# Altium schematic sheet STM32主板V1.0.SchDoc
size 660 x 241 mm
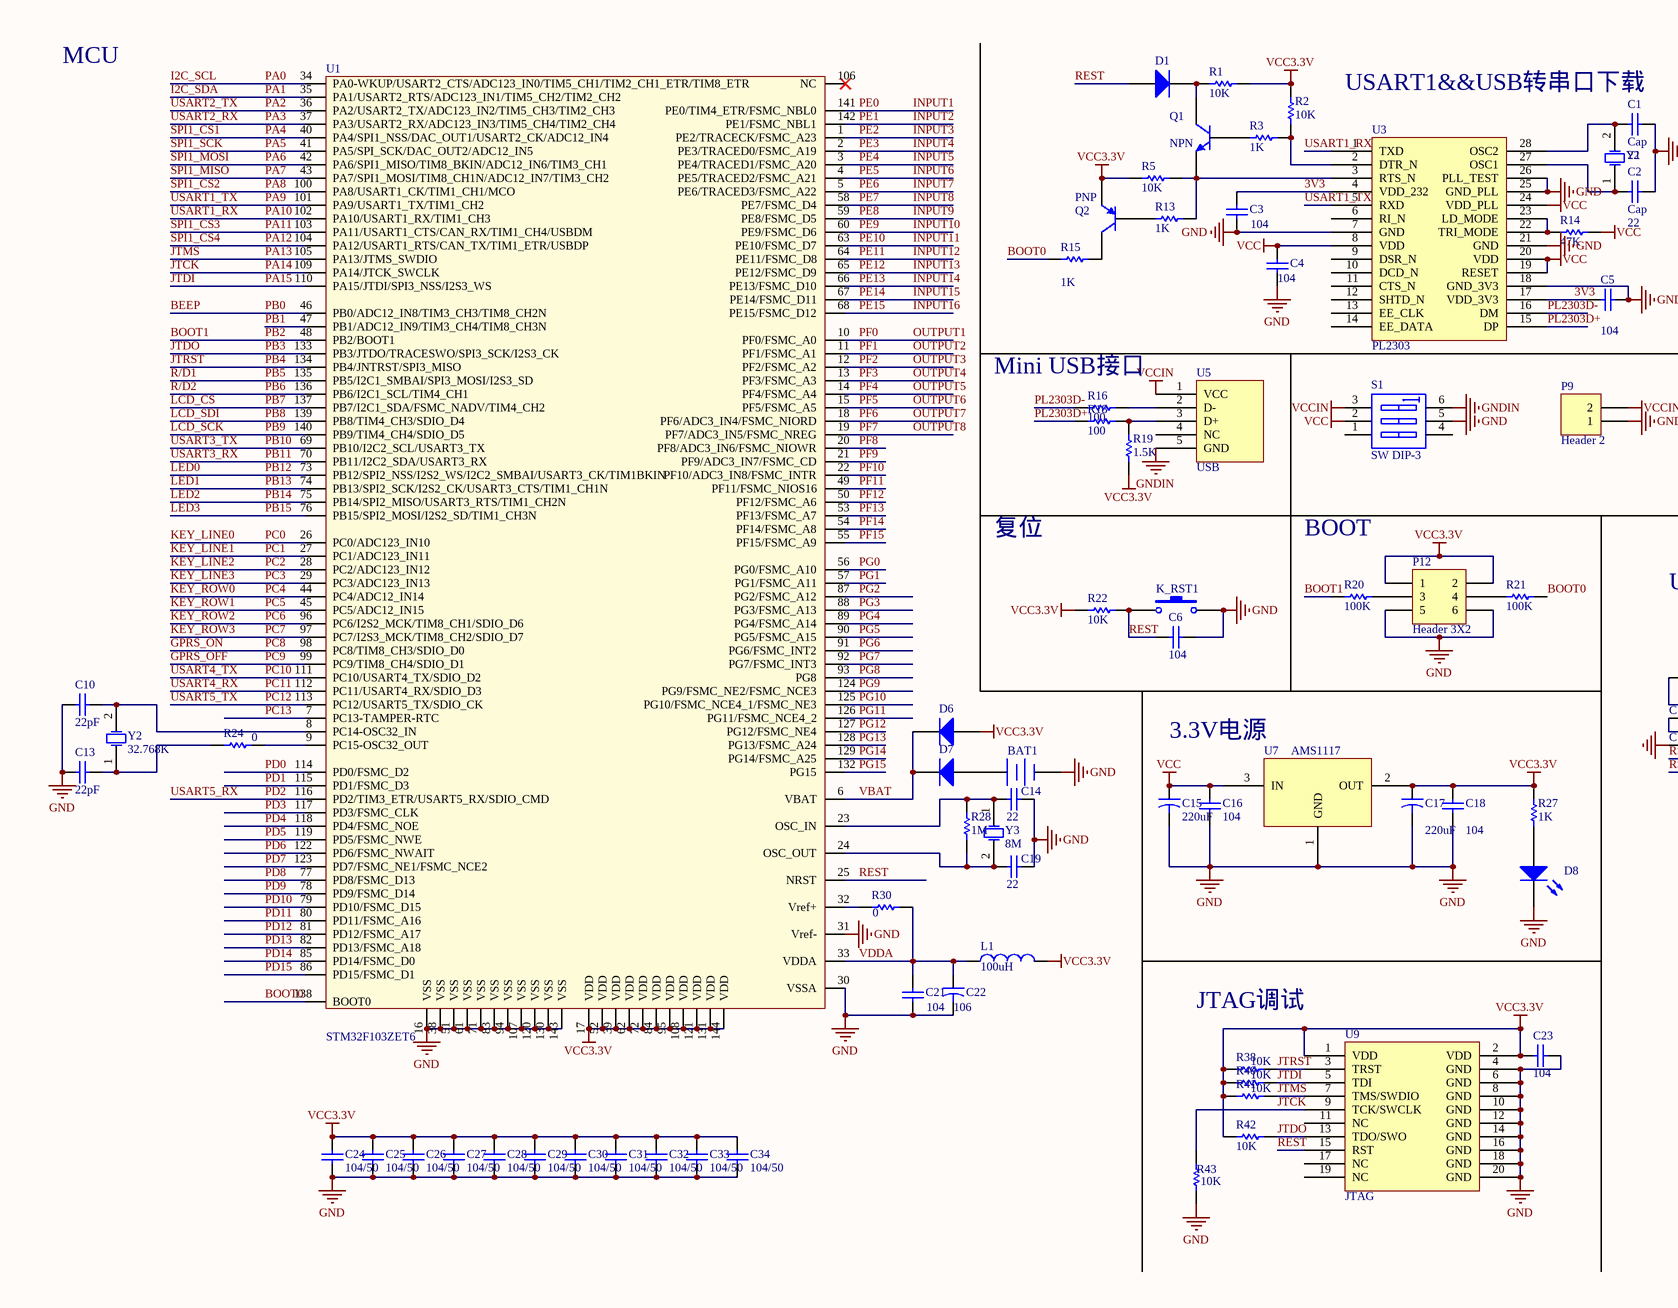
[diagram p0: STM32主板V1.0.SchDoc, left]
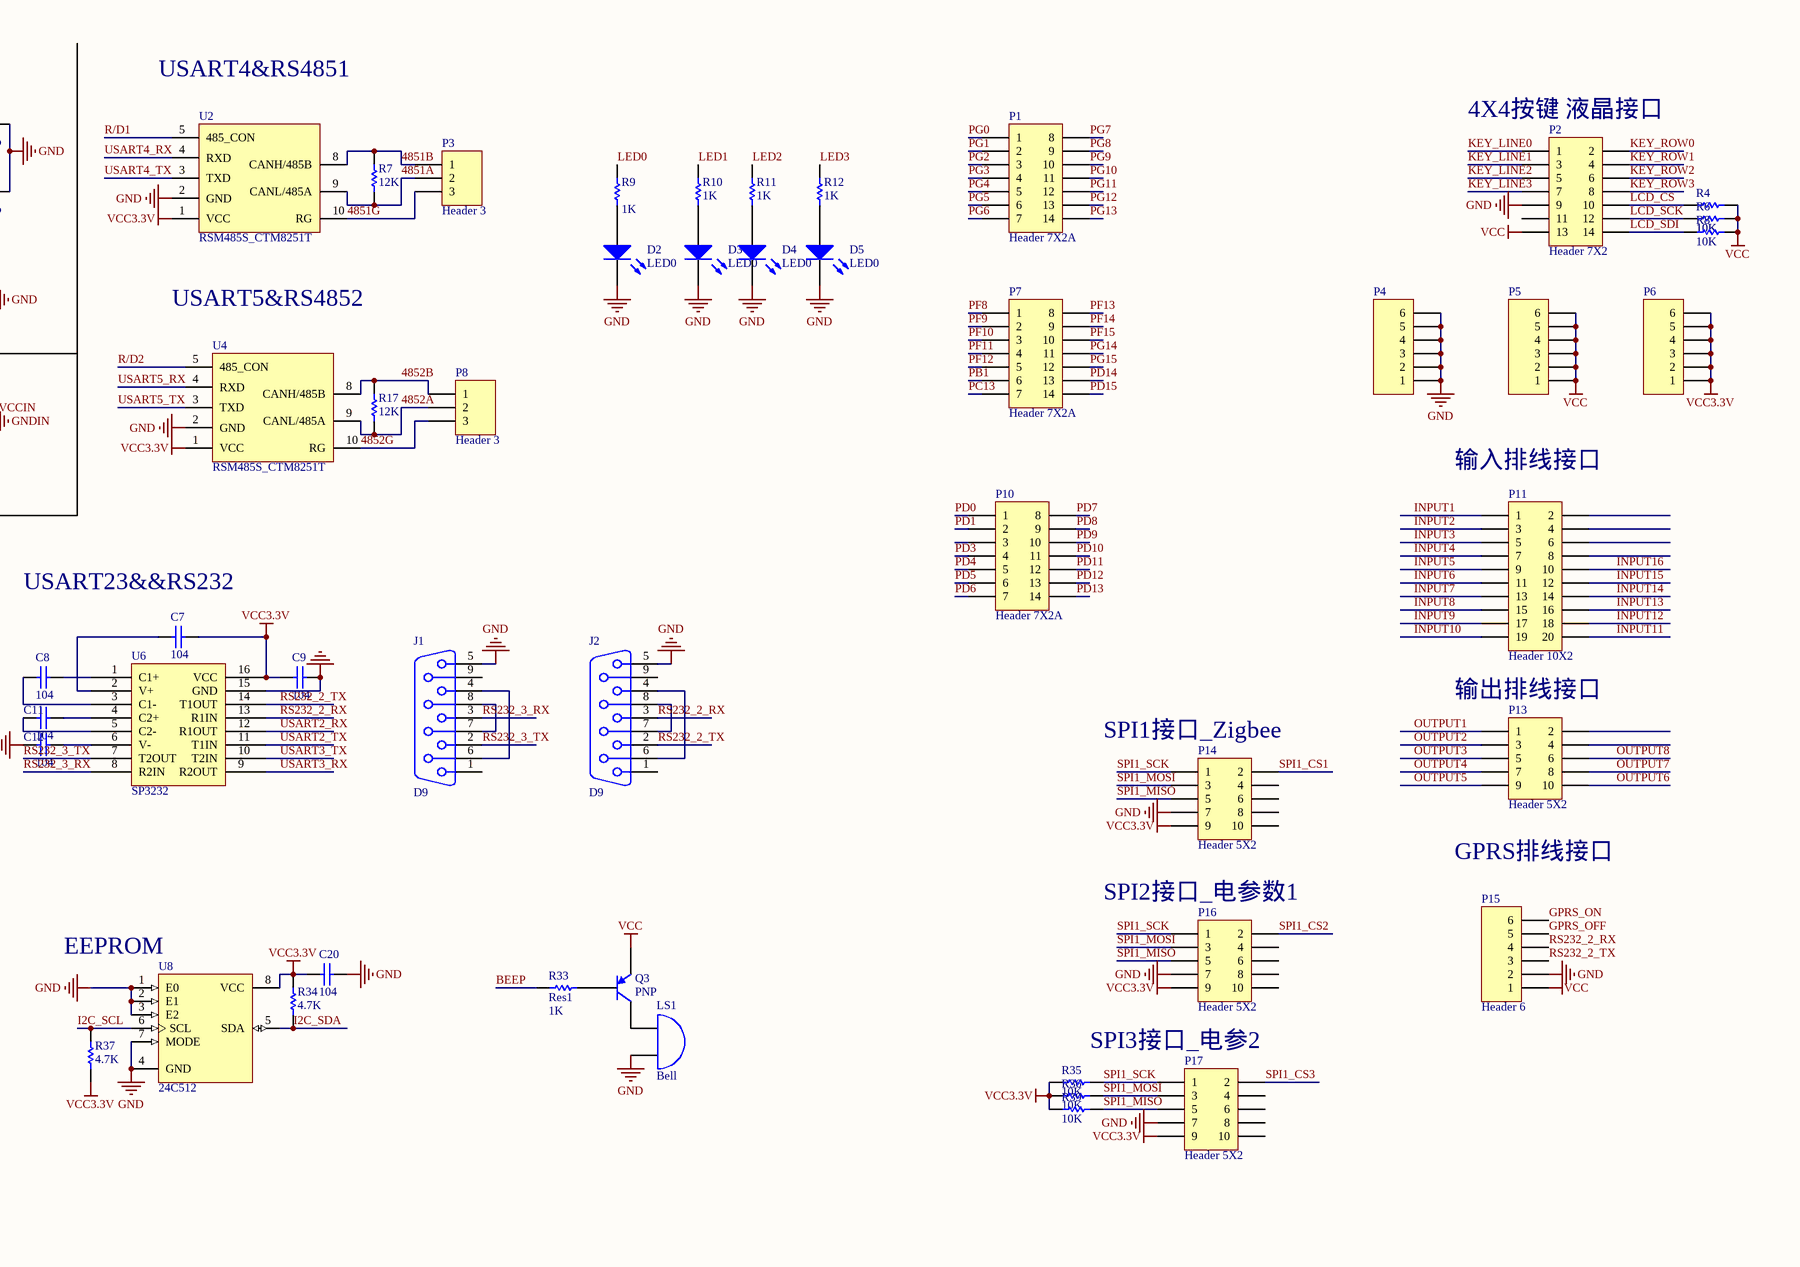
[diagram p1: STM32主板V1.0.SchDoc, right]

## Parts
BAT1  Battery  [电池槽]  (value not drawn)
C1  Cap  value 22  [普通贴片电容]
C2  Cap  value 22  [普通贴片电容]
C3  value 104  [普通贴片电容]  (hidden comment: Cap)
C4  value 104  [普通贴片电容]  (hidden comment: Cap)
C5  value 104  [普通贴片电容]  (hidden comment: Cap)
C6  value 104  [普通贴片电容]  (hidden comment: Cap)
C7  value 104  [普通贴片电容]
C8  value 104  [普通贴片电容]
C9  value 104  [普通贴片电容]
C10  value 22pF  [普通贴片电容]  (hidden comment: Cap)
C11  value 104  [普通贴片电容]
C12  value 104  [普通贴片电容]
C13  value 22pF  [普通贴片电容]  (hidden comment: Cap)
C14  22  [普通贴片电容]
C15  value 220uF  [电容100uf]  (hidden comment: Cap2)
C16  value 104  [普通贴片电容]  (hidden comment: Cap)
C17  value 220uF  [电容100uf]  (hidden comment: Cap2)
C18  value 104  [普通贴片电容]  (hidden comment: Cap)
C19  22  [普通贴片电容]
C20  value 104  [普通贴片电容]  (hidden comment: Cap)
C21  value 104  [普通贴片电容]  (hidden comment: Cap)
C22  value 106  [普通贴片电容]  (hidden comment: Cap2)
C23  value 104  [普通贴片电容]  (hidden comment: Cap)
C24  value 104/50  [普通贴片电容]  (hidden comment: Cap)
C25  value 104/50  [普通贴片电容]  (hidden comment: Cap)
C26  value 104/50  [普通贴片电容]  (hidden comment: Cap)
C27  value 104/50  [普通贴片电容]  (hidden comment: Cap)
C28  value 104/50  [普通贴片电容]  (hidden comment: Cap)
C29  value 104/50  [普通贴片电容]  (hidden comment: Cap)
C30  value 104/50  [普通贴片电容]  (hidden comment: Cap)
C31  value 104/50  [普通贴片电容]  (hidden comment: Cap)
C32  value 104/50  [普通贴片电容]  (hidden comment: Cap)
C33  value 104/50  [普通贴片电容]  (hidden comment: Cap)
C34  value 104/50  [普通贴片电容]  (hidden comment: Cap)
D1  Diode  [贴片二极管]  (value not drawn)
D2  LED0  [贴片LED灯]
D3  LED0  [贴片LED灯]
D4  LED0  [贴片LED灯]
D5  LED0  [贴片LED灯]
D6  Diode 1N4148  [贴片二极管]  (value not drawn)
D7  Diode 1N4148  [贴片二极管]  (value not drawn)
D8  LED0  [贴片LED灯]  (value not drawn)
J1  D9  [串口]
J2  D9  [串口]
K_RST1  SW-PB  [按键]  (value not drawn)
L1  value 100uH  [贴片电阻]  (hidden comment: Inductor)
LS1  Bell  [BELL]
P1  Header 7X2A  [CON14a]
P2  Header 7X2  [CON14]
P3  Header 3  [HDR1X3]
P4  Header 6  [HDR1X6]  (value not drawn)
P5  Header 6  [HDR1X6]  (value not drawn)
P6  Header 6  [HDR1X6]  (value not drawn)
P7  Header 7X2A  [CON14a]
P8  Header 3  [HDR1X3]
P9  Header 2  [HDR1X2]
P10  Header 7X2A  [CON14a]
P11  Header 10X2  [CON20]
P12  Header 3X2  [HDR2X3]
P13  Header 5X2  [CON10]
P14  Header 5X2  [CON10]
P15  Header 6  [HDR1X6]
P16  Header 5X2  [CON10]
P17  Header 5X2  [CON10]
Q1  NPN  [三极管 NPN]
Q2  PNP  [三极管 PNP]
Q3  PNP  [三极管 PNP]
R1  value 10K  [贴片电阻]  (hidden comment: Res1)
R2  value 10K  [贴片电阻]  (hidden comment: Res1)
R3  value 1K  [贴片电阻]  (hidden comment: Res1)
R4  value 10K  [贴片电阻]  (hidden comment: Res1)
R5  value 10K  [贴片电阻]  (hidden comment: Res1)
R6  value 10K  [贴片电阻]  (hidden comment: Res1)
R7  value 12K  [贴片电阻]  (hidden comment: Res1)
R8  value 10K  [贴片电阻]  (hidden comment: Res1)
R9  value 1K  [贴片电阻]  (hidden comment: Res1)
R10  value 1K  [贴片电阻]  (hidden comment: Res1)
R11  value 1K  [贴片电阻]  (hidden comment: Res1)
R12  value 1K  [贴片电阻]  (hidden comment: Res1)
R13  value 1K  [贴片电阻]  (hidden comment: Res1)
R14  value 47K  [贴片电阻]  (hidden comment: Res1)
R15  value 1K  [贴片电阻]  (hidden comment: Res1)
R16  value 100  [贴片电阻]  (hidden comment: Res1)
R17  value 12K  [贴片电阻]  (hidden comment: Res1)
R18  value 100  [贴片电阻]  (hidden comment: Res1)
R19  value 1.5K  [贴片电阻]  (hidden comment: Res1)
R20  value 100K  [贴片电阻]  (hidden comment: Res1)
R21  value 100K  [贴片电阻]  (hidden comment: Res1)
R22  value 10K  [贴片电阻]  (hidden comment: Res1)
R24  value 0  [贴片电阻]  (hidden comment: Res1)
R27  value 1K  [贴片电阻]  (hidden comment: Res1)
R28  value 1M  [贴片电阻]  (hidden comment: Res1)
R30  value 0  [贴片电阻]  (hidden comment: Res1)
R33  Res1  value 1K  [贴片电阻]
R34  value 4.7K  [贴片电阻]  (hidden comment: Res1)
R35  value 10K  [贴片电阻]  (hidden comment: Res1)
R36  value 10K  [贴片电阻]  (hidden comment: Res1)
R37  value 4.7K  [贴片电阻]  (hidden comment: Res1)
R38  value 10K  [贴片电阻]  (hidden comment: Res1)
R39  value 10K  [贴片电阻]  (hidden comment: Res1)
R40  value 10K  [贴片电阻]  (hidden comment: Res1)
R41  value 10K  [贴片电阻]  (hidden comment: Res1)
R42  value 10K  [贴片电阻]  (hidden comment: Res1)
R43  value 10K  [贴片电阻]  (hidden comment: Res1)
S1  SW DIP-3  [开关]
U1  STM32F103ZET6  [LQFP144]
U2  RSM485S_CTM8251T  [RS485]
U3  PL2303  [SSOP28]
U4  RSM485S_CTM8251T  [RS485]
U5  USB  [miniUSB]
U6  SP3232  [SSOP16]
U7  AMS1117  [AMS1117]
U8  24C512  [SOP8]
U9  JTAG  [CON20]
Y1  XTAL  [晶振]  (value not drawn)
Y2  32.768K  [R38]
Y3  8M  [晶振]

## Nets
GND: BAT1.2(-) C1.1 C2.1 C3.1 C4.1 C5.2 C6.2 C9.2 C10.2 C12.1 C13.2 C14.1 C15.2 C16.1 C17.2 C18.1 C19.1 C20.1 C21.1 C22.2 C23.1 C24.1 C25.1 C26.1 C27.1 C28.1 C29.1 C30.1 C31.1 C32.1 C33.1 C34.1 D2.2(K) D3.2(K) D4.2(K) D5.2(K) D8.2(K) J1.5 J2.5 K_RST1.2 LS1.2(B) P2.9 P4.1 P4.2 P4.3 P4.4 P4.5 P4.6 P12.5 P12.6 P14.7 P15.2 P16.7 P17.7 R43.1 S1.5(B2) U1.16(VSS) U1.30(VSSA) U1.31(Vref-) U1.38(VSS) U1.51(VSS) U1.61(VSS) U1.71(VSS) U1.83(VSS) U1.94(VSS) U1.107(VSS) U1.120(VSS) U1.130(VSS) U1.143(VSS) U2.2(GND) U3.7(GND) U3.18(GND_3V3) U3.21(GND) U3.25(GND_PLL) U3.26(PLL_TEST) U4.2(GND) U6.15(GND) U7.1(GND) U8.1(E0) U8.2(E1) U8.3(E2) U8.4(GND) U8.7(MODE) U9.4(GND) U9.6(GND) U9.8(GND) U9.10(GND) U9.12(GND) U9.14(GND) U9.16(GND) U9.18(GND) U9.20(GND)
GNDIN: P9.1 S1.6(B1) U5.5(GND)
VCC: C4.2 C15.1 C16.2 P2.13 P5.1 P5.2 P5.3 P5.4 P5.5 P5.6 P15.1 Q3.3(E) R4.2 R6.2 R8.2 R14.2 S1.2(A2) U3.8(VDD) U3.19(RESET) U3.20(VDD) U3.24(VDD_PLL) U7.3(IN)
VCC3.3V: C7.2 C9.1 C17.1 C18.2 C20.2 C23.2 C24.2 C25.2 C26.2 C27.2 C28.2 C29.2 C30.2 C31.2 C32.2 C33.2 C34.2 D6.1(A) L1.2 P6.1 P6.2 P6.3 P6.4 P6.5 P6.6 P12.1 P12.2 P14.9 P16.9 P17.9 Q2.3(E) R1.2 R2.2 R5.1 R19.1 R22.2 R27.1 R34.2 R35.2 R36.2 R37.1 R38.1 R39.2 R40.1 R41.1 R42.1 U1.17(VDD) U1.39(VDD) U1.52(VDD) U1.62(VDD) U1.72(VDD) U1.84(VDD) U1.95(VDD) U1.108(VDD) U1.121(VDD) U1.131(VDD) U1.144(VDD) U2.1(VCC) U4.1(VCC) U6.16(VCC) U7.2(OUT) U8.8(VCC) U9.1(VDD) U9.2(VDD)
VCCIN: P9.2 S1.3(A3) U5.1(VCC)
3V3: C3.2 C5.1 U3.4(VDD_232) U3.17(VDD_3V3)
4851A: P3.2 R7.1 U2.9(CANL/485A)
4851B: P3.1 R7.2 U2.8(CANH/485B)
4851G: P3.3 U2.10(RG)
4852A: P8.2 R17.1 U4.9(CANL/485A)
4852B: P8.1 R17.2 U4.8(CANH/485B)
4852G: P8.3 U4.10(RG)
BEEP: R33.1 U1.46(PB0/ADC12_IN8/TIM3_CH3/TIM8_CH2N)  [also labelled PB0]
BOOT0: R15.1 R21.2 U1.138(BOOT0)
BOOT1: R20.1 U1.48(PB2/BOOT1)  [also labelled PB2]
GPRS_OFF: P15.5 U1.99(PC9/TIM8_CH4/SDIO_D1)  [also labelled PC9]
GPRS_ON: P15.6 U1.98(PC8/TIM8_CH3/SDIO_D0)  [also labelled PC8]
I2C_SCL: R37.2 U1.34(PA0-WKUP/USART2_CTS/ADC123_IN0/TIM5_CH1/TIM2_CH1_ETR/TIM8_ETR) U8.6(SCL)  [also labelled PA0]
I2C_SDA: R34.1 U1.35(PA1/USART2_RTS/ADC123_IN1/TIM5_CH2/TIM2_CH2) U8.5(SDA)  [also labelled PA1]
INPUT1: P11.1 U1.141(PE0/TIM4_ETR/FSMC_NBL0)  [also labelled PE0]
INPUT2: P11.3 U1.142(PE1/FSMC_NBL1)  [also labelled PE1]
INPUT3: P11.5 U1.1(PE2/TRACECK/FSMC_A23)  [also labelled PE2]
INPUT4: P11.7 U1.2(PE3/TRACED0/FSMC_A19)  [also labelled PE3]
INPUT5: P11.9 U1.3(PE4/TRACED1/FSMC_A20)  [also labelled PE4]
INPUT6: P11.11 U1.4(PE5/TRACED2/FSMC_A21)  [also labelled PE5]
INPUT7: P11.13 U1.5(PE6/TRACED3/FSMC_A22)  [also labelled PE6]
INPUT8: P11.15 U1.58(PE7/FSMC_D4)  [also labelled PE7]
INPUT9: P11.17 U1.59(PE8/FSMC_D5)  [also labelled PE8]
INPUT10: P11.19 U1.60(PE9/FSMC_D6)  [also labelled PE9]
INPUT11: P11.20 U1.63(PE10/FSMC_D7)  [also labelled PE10]
INPUT12: P11.18 U1.64(PE11/FSMC_D8)  [also labelled PE11]
INPUT13: P11.16 U1.65(PE12/FSMC_D9)  [also labelled PE12]
INPUT14: P11.14 U1.66(PE13/FSMC_D10)  [also labelled PE13]
INPUT15: P11.12 U1.67(PE14/FSMC_D11)  [also labelled PE14]
INPUT16: P11.10 U1.68(PE15/FSMC_D12)  [also labelled PE15]
JTCK: R43.2 U1.109(PA14/JTCK_SWCLK) U9.9(TCK/SWCLK)  [also labelled PA14]
JTDI: R40.2 U1.110(PA15/JTDI/SPI3_NSS/I2S3_WS) U9.5(TDI)  [also labelled PA15]
JTDO: R42.2 U1.133(PB3/JTDO/TRACESWO/SPI3_SCK/I2S3_CK) U9.13(TDO/SWO)  [also labelled PB3]
JTMS: R41.2 U1.105(PA13/JTMS_SWDIO) U9.7(TMS/SWDIO)  [also labelled PA13]
JTRST: R38.2 U1.134(PB4/JNTRST/SPI3_MISO) U9.3(TRST)  [also labelled PB4]
KEY_LINE0: P2.1 U1.26(PC0/ADC123_IN10)  [also labelled PC0]
KEY_LINE1: P2.3 U1.27(PC1/ADC123_IN11)  [also labelled PC1]
KEY_LINE2: P2.5 U1.28(PC2/ADC123_IN12)  [also labelled PC2]
KEY_LINE3: P2.7 U1.29(PC3/ADC123_IN13)  [also labelled PC3]
KEY_ROW0: P2.2 U1.44(PC4/ADC12_IN14)  [also labelled PC4]
KEY_ROW1: P2.4 U1.45(PC5/ADC12_IN15)  [also labelled PC5]
KEY_ROW2: P2.6 U1.96(PC6/I2S2_MCK/TIM8_CH1/SDIO_D6)  [also labelled PC6]
KEY_ROW3: P2.8 U1.97(PC7/I2S3_MCK/TIM8_CH2/SDIO_D7)  [also labelled PC7]
LCD_CS: P2.10 R4.1 U1.137(PB7/I2C1_SDA/FSMC_NADV/TIM4_CH2)  [also labelled PB7]
LCD_SCK: P2.12 R6.1 U1.140(PB9/TIM4_CH4/SDIO_D5)  [also labelled PB9]
LCD_SDI: P2.14 R8.1 U1.139(PB8/TIM4_CH3/SDIO_D4)  [also labelled PB8]
LED0: R9.2 U1.73(PB12/SPI2_NSS/I2S2_WS/I2C2_SMBAI/USART3_CK/TIM1BKIN)  [also labelled PB12]
LED1: R10.2 U1.74(PB13/SPI2_SCK/I2S2_CK/USART3_CTS/TIM1_CH1N)  [also labelled PB13]
LED2: R11.2 U1.75(PB14/SPI2_MISO/USART3_RTS/TIM1_CH2N)  [also labelled PB14]
LED3: R12.2 U1.76(PB15/SPI2_MOSI/I2S2_SD/TIM1_CH3N)  [also labelled PB15]
OUTPUT1: P13.1 U1.10(PF0/FSMC_A0)  [also labelled PF0]
OUTPUT2: P13.3 U1.11(PF1/FSMC_A1)  [also labelled PF1]
OUTPUT3: P13.5 U1.12(PF2/FSMC_A2)  [also labelled PF2]
OUTPUT4: P13.7 U1.13(PF3/FSMC_A3)  [also labelled PF3]
OUTPUT5: P13.9 U1.14(PF4/FSMC_A4)  [also labelled PF4]
OUTPUT6: P13.10 U1.15(PF5/FSMC_A5)  [also labelled PF5]
OUTPUT7: P13.8 U1.18(PF6/ADC3_IN4/FSMC_NIORD)  [also labelled PF6]
OUTPUT8: P13.6 U1.19(PF7/ADC3_IN5/FSMC_NREG)  [also labelled PF7]
PA2: U1.36(PA2/USART2_TX/ADC123_IN2/TIM5_CH3/TIM2_CH3) U6.11(T1IN)  [also labelled USART2_TX]
PA3: U1.37(PA3/USART2_RX/ADC123_IN3/TIM5_CH4/TIM2_CH4) U6.12(R1OUT)  [also labelled USART2_RX]
PA4: P14.2 U1.40(PA4/SPI1_NSS/DAC_OUT1/USART2_CK/ADC12_IN4)  [also labelled SPI1_CS1]
PA5: P14.1 P16.1 P17.1 R35.1 U1.41(PA5/SPI_SCK/DAC_OUT2/ADC12_IN5)  [also labelled SPI1_SCK]
PA6: P14.3 P16.3 P17.3 R36.1 U1.42(PA6/SPI1_MISO/TIM8_BKIN/ADC12_IN6/TIM3_CH1)  [also labelled SPI1_MOSI]
PA7: P14.5 P16.5 P17.5 R39.1 U1.43(PA7/SPI1_MOSI/TIM8_CH1N/ADC12_IN7/TIM3_CH2)  [also labelled SPI1_MISO]
PA8: P16.2 U1.100(PA8/USART1_CK/TIM1_CH1/MCO)  [also labelled SPI1_CS2]
PA9: U1.101(PA9/USART1_TX/TIM1_CH2) U3.5(RXD)  [also labelled USART1_TX]
PA10: U1.102(PA10/USART1_RX/TIM1_CH3) U3.1(TXD)  [also labelled USART1_RX]
PA11: P17.2 U1.103(PA11/USART1_CTS/CAN_RX/TIM1_CH4/USBDM)  [also labelled SPI1_CS3]
PA12: U1.104(PA12/USART1_RTS/CAN_TX/TIM1_ETR/USBDP)  [also labelled SPI1_CS4]
PB1: P7.6 U1.47(PB1/ADC12_IN9/TIM3_CH4/TIM8_CH3N)
PB5: U1.135(PB5/I2C1_SMBAI/SPI3_MOSI/I2S3_SD) U2.5(485_CON)  [also labelled R/D1]
PB6: U1.136(PB6/I2C1_SCL/TIM4_CH1) U4.5(485_CON)  [also labelled R/D2]
PB10: U1.69(PB10/I2C2_SCL/USART3_TX) U6.10(T2IN)  [also labelled USART3_TX]
PB11: U1.70(PB11/I2C2_SDA/USART3_RX) U6.9(R2OUT)  [also labelled USART3_RX]
PC10: U1.111(PC10/USART4_TX/SDIO_D2) U2.3(TXD)  [also labelled USART4_TX]
PC11: U1.112(PC11/USART4_RX/SDIO_D3) U2.4(RXD)  [also labelled USART4_RX]
PC12: U1.113(PC12/USART5_TX/SDIO_CK) U4.3(TXD)  [also labelled USART5_TX]
PC13: P7.7 U1.7(PC13-TAMPER-RTC)
PD0: P10.1 U1.114(PD0/FSMC_D2)
PD1: P10.2 U1.115(PD1/FSMC_D3)
PD2: U1.116(PD2/TIM3_ETR/USART5_RX/SDIO_CMD) U4.4(RXD)  [also labelled USART5_RX]
PD3: P10.4 U1.117(PD3/FSMC_CLK)
PD4: P10.5 U1.118(PD4/FSMC_NOE)
PD5: P10.6 U1.119(PD5/FSMC_NWE)
PD6: P10.7 U1.122(PD6/FSMC_NWAIT)
PD7: P10.8 U1.123(PD7/FSMC_NE1/FSMC_NCE2)
PD8: P10.9 U1.77(PD8/FSMC_D13)
PD9: P10.10 U1.78(PD9/FSMC_D14)
PD10: P10.11 U1.79(PD10/FSMC_D15)
PD11: P10.12 U1.80(PD11/FSMC_A16)
PD12: P10.13 U1.81(PD12/FSMC_A17)
PD13: P10.14 U1.82(PD13/FSMC_A18)
PD14: P7.13 U1.85(PD14/FSMC_D0)
PD15: P7.14 U1.86(PD15/FSMC_D1)
PF8: P7.1 U1.20(PF8/ADC3_IN6/FSMC_NIOWR)
PF9: P7.2 U1.21(PF9/ADC3_IN7/FSMC_CD)
PF10: P7.3 U1.22(PF10/ADC3_IN8/FSMC_INTR)
PF11: P7.4 U1.49(PF11/FSMC_NIOS16)
PF12: P7.5 U1.50(PF12/FSMC_A6)
PF13: P7.8 U1.53(PF13/FSMC_A7)
PF14: P7.9 U1.54(PF14/FSMC_A8)
PF15: P7.10 U1.55(PF15/FSMC_A9)
PG0: P1.1 U1.56(PG0/FSMC_A10)
PG1: P1.2 U1.57(PG1/FSMC_A11)
PG2: P1.3 U1.87(PG2/FSMC_A12)
PG3: P1.4 U1.88(PG3/FSMC_A13)
PG4: P1.5 U1.89(PG4/FSMC_A14)
PG5: P1.6 U1.90(PG5/FSMC_A15)
PG6: P1.7 U1.91(PG6/FSMC_INT2)
PG7: P1.8 U1.92(PG7/FSMC_INT3)
PG8: P1.9 U1.93(PG8)
PG9: P1.10 U1.124(PG9/FSMC_NE2/FSMC_NCE3)
PG10: P1.11 U1.125(PG10/FSMC_NCE4_1/FSMC_NE3)
PG11: P1.12 U1.126(PG11/FSMC_NCE4_2)
PG12: P1.13 U1.127(PG12/FSMC_NE4)
PG13: P1.14 U1.128(PG13/FSMC_A24)
PG14: P7.11 U1.129(PG14/FSMC_A25)
PG15: P7.12 U1.132(PG15)
PL2303D+: R18.1 U3.15(DP)
PL2303D-: R16.1 U3.16(DM)
REST: C6.1 D1.1(A) K_RST1.1 R22.1 U1.25(NRST) U9.15(RST)
RS232_2_RX: J2.3 P15.4 U6.13(R1IN)
RS232_2_TX: J2.2 P15.3 U6.14(T1OUT)
RS232_3_RX: J1.3 U6.8(R2IN)
RS232_3_TX: J1.2 U6.7(T2OUT)
VBAT: D6.2(K) D7.2(K) U1.6(VBAT)
VDDA: C21.2 C22.1 L1.1 R30.2 U1.33(VDDA)
NetBAT1_1: BAT1.1(+) D7.1(A)
NetC1_2: C1.2 U3.28(OSC2) Y1.2(OSC2)
NetC2_2: C2.2 U3.27(OSC1) Y1.1(OSC1)
NetC7_1: C7.1 U6.2(V+)
NetC8_1: C8.1 U6.3(C1-)
NetC8_2: C8.2 U6.1(C1+)
NetC10_1: C10.1 U1.8(PC14-OSC32_IN) Y2.2(OSC2)
NetC11_1: C11.1 U6.5(C2-)
NetC11_2: C11.2 U6.4(C2+)
NetC12_2: C12.2 U6.6(V-)
NetC13_1: C13.1 R24.1 Y2.1(OSC1)
NetC14_2: C14.2 R28.1 U1.23(OSC_IN) Y3.1(OSC1)
NetC19_2: C19.2 R28.2 U1.24(OSC_OUT) Y3.2(OSC2)
NetD1_2: D1.2(K) Q1.1(C) R1.1
NetD2_1: D2.1(A) R9.1
NetD3_1: D3.1(A) R10.1
NetD4_1: D4.1(A) R11.1
NetD5_1: D5.1(A) R12.1
NetD8_1: D8.1(A) R27.2
NetJ1_4: J1.4 J1.6
NetJ1_7: J1.7 J1.8
NetJ2_4: J2.4 J2.6
NetJ2_7: J2.7 J2.8
NetLS1_1: LS1.1(A) Q3.1(C)
NetP12_3: P12.3 R20.2
NetP12_4: P12.4 R21.1
NetQ1_2: Q1.2(B) R3.2
NetQ1_3: Q1.3(E) R5.2 R13.2 U3.3(RTS_N)
NetQ2_1: Q2.1(C) R15.2
NetQ2_2: Q2.2(B) R13.1
NetQ3_2: Q3.2(B) R33.2
NetR2_1: R2.1 R3.1 U3.2(DTR_N)
NetR14_1: R14.1 U3.22(TRI_MODE) U3.23(LD_MODE)
NetR16_2: R16.2 U5.2(D-)
NetR18_2: R18.2 R19.2 U5.3(D+)
NetR24_2: R24.2 U1.9(PC15-OSC32_OUT)
NetR30_1: R30.1 U1.32(Vref+)

Not connected (* = marked no-connect by the designer): J1 1 9 10(MH1) 11(MH2); J2 1 9 10(MH1) 11(MH2); P2 11; P10 3; P11 2 4 6 8; P13 2 4; P14 4 6 8 10; P16 4 6 8 10; P17 4 6 8 10; S1 1(A1) 4(B3); U1 106(NC)*; U3 6(RI_N) 9(DSR_N) 10(DCD_N) 11(CTS_N) 12(SHTD_N) 13(EE_CLK) 14(EE_DATA); U5 4(NC); U9 11(NC) 17(NC) 19(NC)

## Notes on the sheet
- MCU
- USART1&&USB转串口下载
- USART4&RS4851
- (near P2) 4X4按键 液晶接口
- USART5&RS4852
- Mini USB接口
- (near P11) 输入排线接口
- 复位
- BOOT
- (near C7) USART23&&RS232
- 输出排线接口
- 3.3V电源
- (near P14) SPI1接口_Zigbee
- (near P16) SPI2接口_电参数1
- GPRS排线接口
- (near U8) EEPROM
- JTAG调试
- SPI3接口_电参2

## Library data of the parts
BAT1 = Battery: Multicell Battery; Published: 24-Mar-1999; LatestRevisionDate: 17-Jul-2002; LatestRevisionNote: Re-released for DXP Platform.; PackageReference: BAT-2; Publisher: Altium Limited
C1-C6 C10 C13 C14 C16 C18-C21 C23-C34 = Cap: Capacitor; Published: 8-Jun-2000; LatestRevisionDate: 17-Jul-2002; LatestRevisionNote: Re-released for DXP Platform.; PackageReference: RAD-0.3; Publisher: Altium Limited
  C14 C19: Value: 22
C7-C9 C11 C12 = Cap Semi: Capacitor (Semiconductor SIM Model); Published: 8-Jun-2000; LatestRevisionDate: 17-Jul-2002; LatestRevisionNote: Re-released for DXP Platform.; PackageReference: C1206; Publisher: Altium Limited
C15 C17 C22 = Cap2: Capacitor; Published: 23-Sep-2002; PackageReference: CAPR5-4X5; Publisher: Altium Limited
D1 = Diode: Default Diode; Published: 8-Jun-2000; LatestRevisionDate: 17-Jul-2002; LatestRevisionNote: Re-released for DXP Platform.; PackageDocument: Sep-1996; PackageReference: SMC; Publisher: Altium Limited; Code_JEDEC: DO-214-AB
D2-D5 D8 = LED0: Typical INFRARED GaAs LED; Published: 8-Jun-2000; LatestRevisionDate: 08-Jul-2005; LatestRevisionNote: Mech Layer 1 removed.; PackageReference: LED-0; Publisher: Altium Limited
D6 D7 = Diode 1N4148: High Conductance Fast Diode; Published: 8-Jun-2000; LatestRevisionDate: 17-Jul-2002; LatestRevisionNote: Re-released for DXP Platform.; DatasheetDocument: 1997; PackageReference: DO-35; Publisher: Altium Limited; Code_JEDEC: DO-204-AH; ComponentLink1Description: Manufacturer Link; ComponentLink1URL: http://www.fairchildsemi.com/; ComponentLink2Description: Datasheet; ComponentLink2URL: http://www.fairchildsemi.com/ds/1N%2F1N4148.pdf
J1 J2 = D Connector 9: Receptacle Assembly, 9 Position, Right Angle; PackageDocument: O; Positions: 9; Published: 15-Jun-2001; LatestRevisionDate: 17-Jul-2002; LatestRevisionNote: Re-released for DXP Platform.; DatasheetDocument: 1-Sep-1999; PackageReference: 788750; Publisher: Altium Limited; Orientation: Right Angle; Gender: Receptacle
K_RST1 = SW-PB: Switch; Published: 24-Mar-1999; LatestRevisionDate: 17-Jul-2002; LatestRevisionNote: Re-released for DXP Platform.; PackageReference: SPST-2; Publisher: Altium Limited
L1 = Inductor: Code_IEC: 1005; Published: 8-Jun-2000; LatestRevisionDate: 17-Jul-2002; LatestRevisionNote: Re-released for DXP Platform.; PackageReference: 0402-A; Publisher: Altium Limited; Code_JEITA: 0402
LS1 = Bell: Electrical Bell; Published: 24-Mar-1999; LatestRevisionDate: 17-Jul-2002; LatestRevisionNote: Re-released for DXP Platform.; PackageReference: PIN2; Publisher: Altium Limited
P1 P7 P10 = Header 7X2A: Header, 7-Pin, Dual row; LatestRevisionDate: 17-Jul-2002; LatestRevisionNote: Re-released for DXP Platform.; Publisher: Altium Limited
P2 = Header 7X2: Header, 7-Pin, Dual row; LatestRevisionDate: 17-Jul-2002; LatestRevisionNote: Re-released for DXP Platform.; Publisher: Altium Limited
P3 P8 = Header 3: Header, 3-Pin; LatestRevisionDate: 17-Jul-2002; LatestRevisionNote: Re-released for DXP Platform.; Publisher: Altium Limited
P4-P6 P15 = Header 6: Header, 6-Pin; LatestRevisionDate: 17-Jul-2002; LatestRevisionNote: Re-released for DXP Platform.; Publisher: Altium Limited
P9 = Header 2: Header, 2-Pin; LatestRevisionDate: 17-Jul-2002; LatestRevisionNote: Re-released for DXP Platform.; Publisher: Altium Limited
P11 = Header 10X2: Header, 10-Pin, Dual row; LatestRevisionDate: 17-Jul-2002; LatestRevisionNote: Re-released for DXP Platform.; Publisher: Altium Limited
P12 = Header 3X2: Header, 3-Pin, Dual row; LatestRevisionDate: 17-Jul-2002; LatestRevisionNote: Re-released for DXP Platform.; Publisher: Altium Limited
P13 P14 P16 P17 = Header 5X2: Header, 5-Pin, Dual row; LatestRevisionDate: 17-Jul-2002; LatestRevisionNote: Re-released for DXP Platform.; Publisher: Altium Limited
Q1 = NPN: NPN Bipolar Transistor; Published: 8-Jun-2000; LatestRevisionDate: 17-Jul-2002; LatestRevisionNote: Re-released for DXP Platform.; PackageReference: TO-226; Publisher: Altium Limited; Code_JEDEC: TO-226-AA
Q2 Q3 = PNP: PNP Bipolar Transistor; Published: 8-Jun-2000; LatestRevisionDate: 17-Jul-2002; LatestRevisionNote: Re-released for DXP Platform.; PackageReference: SOT-23B; Publisher: Altium Limited; Code_JEDEC: SOT-23
R1-R22 R24 R27 R28 R30 R33-R43 = Res1: Resistor; Published: 8-Jun-2000; LatestRevisionDate: 17-Jul-2002; LatestRevisionNote: Re-released for DXP Platform.; PackageReference: AXIAL-0.3; Publisher: Altium Limited
S1 = SW DIP-3: DIP Switch, 3 Position, SPST; pin to pad: 1>3 3>1; Published: 24-Mar-1999; LatestRevisionDate: 17-Jul-2002; LatestRevisionNote: Re-released for DXP Platform.; PackageReference: DIP-6; Publisher: Altium Limited; Code_JEDEC: MO-001-AM
U6 = MAX232
U8 = ST24C02M1: Serial 2K (256 x 8) EEPROM; Published: 24-Aug-2001; LatestRevisionDate: 13-Apr-2006; LatestRevisionNote: IPC-7351 Footprint Added.; DatasheetVersion: Nov-1997; PackageVersion: Jul-1999; PackageReference: SOP8; Publisher: Altium Limited; PackageDescription: 8-Pin Small Outline Integrated Circuit 1.27 mm Pitch; ComponentLink1Description: Manufacturer Link; ComponentLink1URL: http://www.st.com/
Y1-Y3 = XTAL: Crystal Oscillator; Published: 8-Jun-2000; LatestRevisionDate: 17-Jul-2002; LatestRevisionNote: Re-released for DXP Platform.; PackageReference: R38; Publisher: Altium Limited